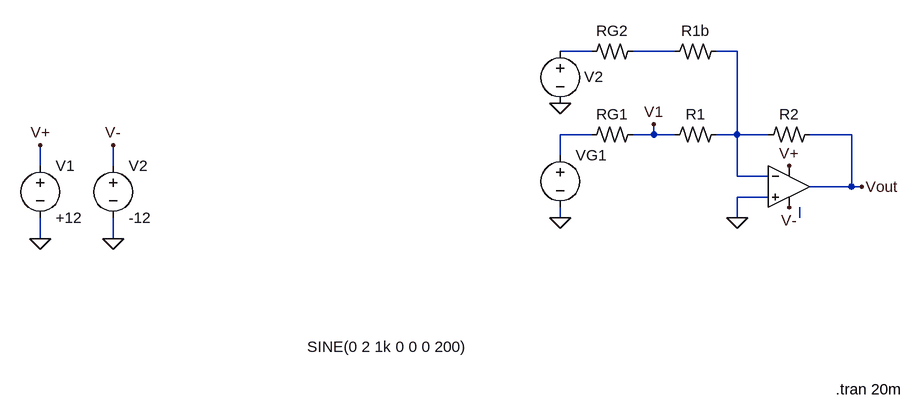
[diagram p0: schematic sum.asc]
sum.asc, the LTspice schematic file:
Version 4
SHEET 1 880 680
WIRE -656 -240 -704 -240
WIRE -528 -240 -592 -240
WIRE -432 -240 -464 -240
WIRE -656 -112 -704 -112
WIRE -560 -112 -560 -128
WIRE -560 -112 -592 -112
WIRE -528 -112 -560 -112
WIRE -432 -112 -432 -240
WIRE -432 -112 -464 -112
WIRE -384 -112 -432 -112
WIRE -256 -112 -320 -112
WIRE -704 -80 -704 -112
WIRE -1504 -64 -1504 -96
WIRE -1392 -64 -1392 -96
WIRE -432 -48 -432 -112
WIRE -384 -48 -432 -48
WIRE -256 -32 -256 -112
WIRE -256 -32 -320 -32
WIRE -240 -32 -256 -32
WIRE -384 -16 -432 -16
WIRE -704 16 -704 0
WIRE -432 16 -432 -16
WIRE -336 16 -336 0
WIRE -1504 48 -1504 16
WIRE -1392 48 -1392 16
FLAG -1504 48 0
FLAG -1392 48 0
FLAG -1504 -96 V+
FLAG -1392 -96 V-
FLAG -240 -32 Vout
FLAG -560 -128 V1
FLAG -352 0 V-
FLAG -352 -64 V+
FLAG -704 16 0
FLAG -432 16 0
FLAG -704 -160 0
SYMBOL voltage -1504 -80 R0
WINDOW 123 24 126 Left 2
WINDOW 39 24 111 Left 2
SYMATTR InstName V1
SYMATTR Value +12
SYMBOL voltage -1392 -80 R0
WINDOW 123 24 126 Left 2
WINDOW 39 24 111 Left 2
SYMATTR InstName V2
SYMATTR Value -12
SYMBOL Opamps/UniversalOpamp2 -352 -32 R0
WINDOW 0 16 -32 Invisible 2
SYMATTR InstName U1
SYMBOL res2 -464 -128 R90
WINDOW 0 0 32 VBottom 2
WINDOW 3 28 32 Invisible 2
SYMATTR InstName R1
SYMATTR Value 8.1k
SYMBOL res2 -320 -128 R90
WINDOW 0 0 32 VBottom 2
WINDOW 3 28 32 Invisible 2
SYMATTR InstName R2
SYMATTR Value R2
SYMBOL voltage -704 -96 R0
WINDOW 3 -389 310 Left 2
WINDOW 39 0 0 Left 0
SYMATTR Value SINE(0 2 1k 0 0 0 200)
SYMATTR Value2 AC 1 0
SYMATTR InstName VG1
SYMBOL res2 -592 -128 R90
WINDOW 0 0 32 VBottom 2
WINDOW 3 28 32 Invisible 2
SYMATTR InstName RG1
SYMATTR Value 600
SYMBOL res2 -464 -256 R90
WINDOW 0 0 32 VBottom 2
WINDOW 3 28 32 Invisible 2
SYMATTR InstName R1b
SYMATTR Value 8.1k
SYMBOL res2 -592 -256 R90
WINDOW 0 0 32 VBottom 2
WINDOW 3 28 32 Invisible 2
SYMATTR InstName RG2
SYMATTR Value Rg2
SYMBOL voltage -704 -256 R0
WINDOW 3 -389 310 Invisible 2
WINDOW 39 0 0 Left 0
WINDOW 0 37 55 Left 2
SYMATTR Value 5
SYMATTR Value2 AC 1 0
SYMATTR InstName V2
TEXT -280 280 Left 2 !.tran 20m

The netlist it stands for:
* sum.asc
V1 V+ 0 +12
V2 V- 0 -12
XU1 0 N003 V+ V- Vout level.2 Avol=1Meg GBW=10Meg Slew=10Meg ilimit=25m rail=0 Vos=0 phimargin=45 en=0 enk=0 in=0 ink=0 Rin=500Meg  ; pins IN+ IN- V+ V- OUT
R1 N003 V1 8.1k
R2 Vout N003 R2
VG1 N004 0 SINE(0 2 1k 0 0 0 200) AC 1 0
RG1 V1 N004 600
R1b N003 N002 8.1k
RG2 N002 N001 Rg2
V2 N001 0 5 AC 1 0
.tran 20m
.lib UniversalOpamps2.sub
.backanno
.end